# EAGLE design rhsspi (EAGLE 6.4)
AUTHOR_NAME: kps; PROJECT_NAME: Split keyboard; VERSION: 20130817
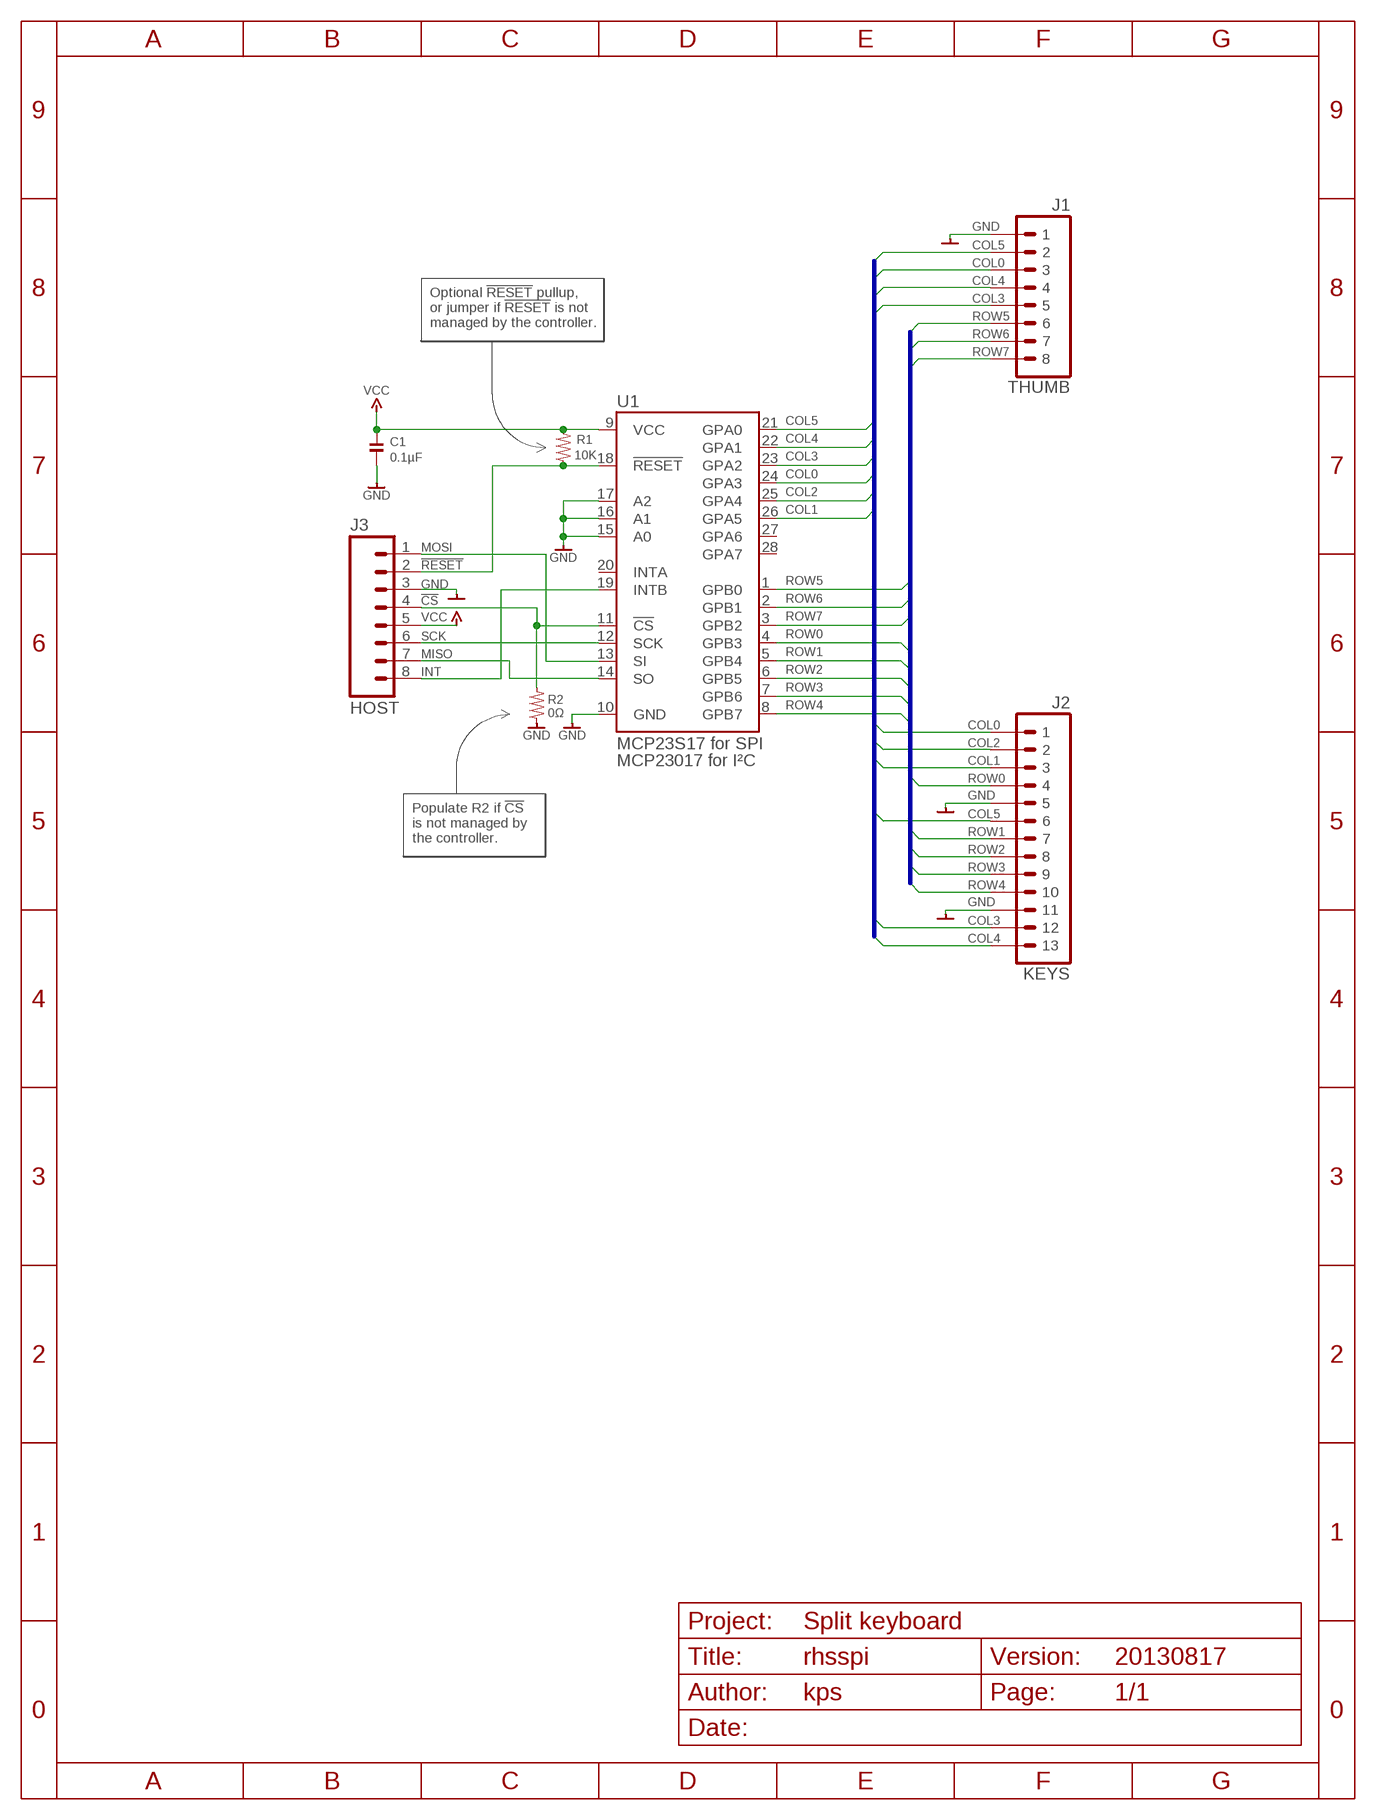
[diagram p0: schematic, sheet 1]

## Parts
C1  0.1µF  CAPACITOR-SCH200-1206  [SMD-1206]
J1  THUMB  J-8-2510  [J-8-2510]
J2  KEYS  J-13-100-ALT-R  [J-13-100-ALT-R]
J3  HOST  J-8-2510  [J-8-2510]
R1  10K  RESISTOR-1206  [SMD-1206]
R2  0Ω  RESISTOR-1206  [SMD-1206]
U1  MCP23S17 for SPI  IC-MCP23S17-SOIC  [IC-28-SOIC-300]

## Nets
!CS: J3.4 R2.2 U1.11(!CS)
!RESET: J3.2 R1.1 U1.18(!RESET)
COL0: J1.3 J2.P1 U1.24(GPA3)
COL1: J2.P3 U1.26(GPA5)
COL2: J2.P2 U1.25(GPA4)
COL3: J1.5 J2.P12 U1.23(GPA2)
COL4: J1.4 J2.P13 U1.22(GPA1)
COL5: J1.2 J2.P6 U1.21(GPA0)
GND: C1.2 J1.1 J2.P5 J2.P11 J3.3 R2.1 U1.10(GND) U1.15(A0) U1.16(A1) U1.17(A2)
INT: J3.8 U1.19(INTB)
MISO: J3.7 U1.14(SO)
MOSI: J3.1 U1.13(SI)
ROW0: J2.P4 U1.4(GPB3)
ROW1: J2.P7 U1.5(GPB4)
ROW2: J2.P8 U1.6(GPB5)
ROW3: J2.P9 U1.7(GPB6)
ROW4: J2.P10 U1.8(GPB7)
ROW5: J1.6 U1.1(GPB0)
ROW6: J1.7 U1.2(GPB1)
ROW7: J1.8 U1.3(GPB2)
SCK: J3.6 U1.12(SCK)
VCC: C1.1 J3.5 R1.2 U1.9(VCC)
Unconnected: U1.20(INTA) U1.27(GPA6) U1.28(GPA7)

## Buses
COL[0..5]
ROW[0..7]

## Notes on the sheet
- Optional !RESET! pullup,
  or jumper if !RESET! is not
  managed by the controller.
- MCP23017 for I²C
- Populate R2 if !CS!
  is not managed by
  the controller.

## Library data of the parts
C1 = misc:CAPACITOR-SCH200
J1 = conn:J-8: 8 pin connector
J2 = conn:J-13: 13 pin connector
J3 = wtf:J-8: 8 pin connector
R1 R2 = misc:RESISTOR
U1 = ic:IC-MCP23S17: Microchip 16-bit I/O Expander MCP23017 - I²C MCP23018 - I²C, open collector, 5V tolerant MCP23S17 - SPI, addressing MCP23S18 - SPI, open collector, 5V tolerant

## Board
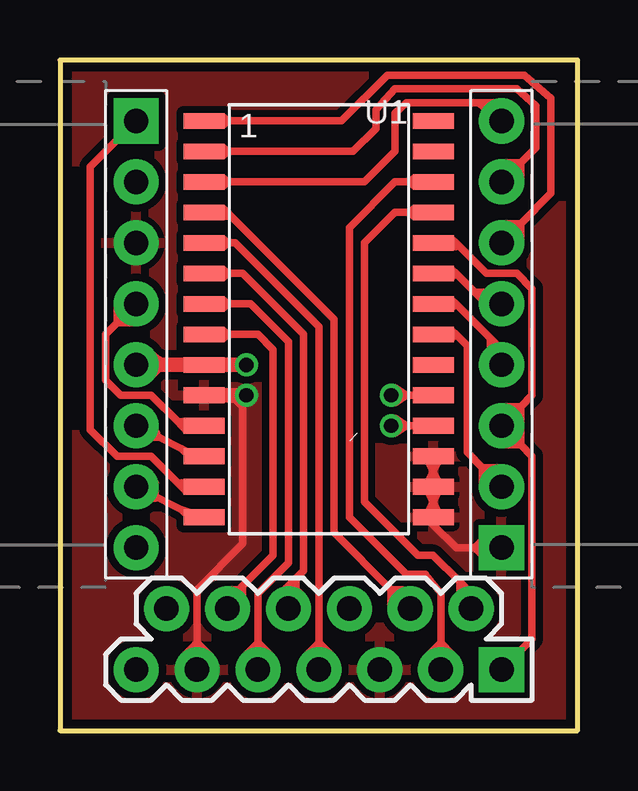
[diagram p1: board, top side]
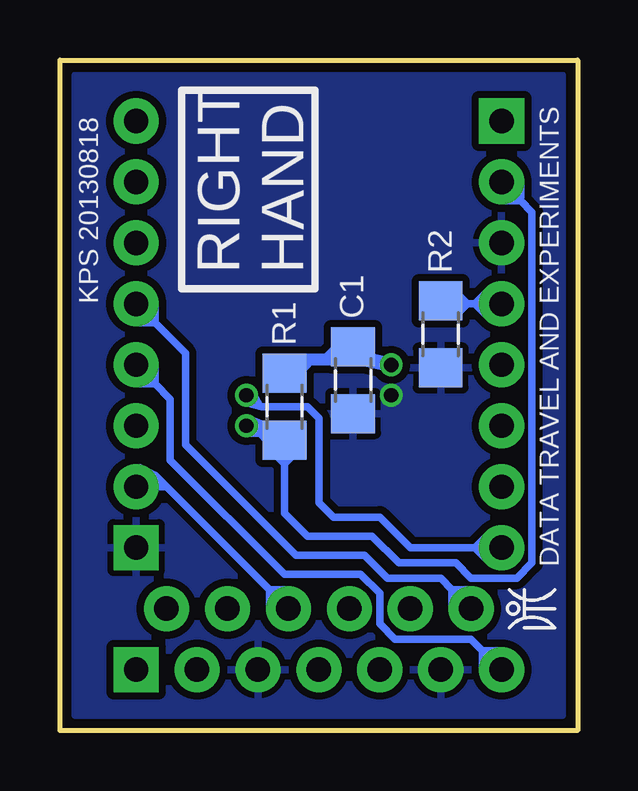
[diagram p2: board, bottom side, seen from below]

Size 21.59 x 27.94 mm. Coordinates in mm from the lower left corner, seen from the top.
Outline: 0,0 21.59,0 21.59,27.94 0,27.94 0,0
Copper layers (1*16): Top 0.0356mm / dielectric 1.5011mm / Bottom 0.0356mm
Design rules "LaenPCBOrder": minimum track width 6mil, minimum drill 13mil, track to track 6mil, track to pad 6mil, pad to pad 6mil, via to via 6mil, smd to smd 6mil, copper to edge 15mil, drill to drill 6mil, minimum pad ring 7mil, minimum via ring 7mil, stop-mask expansion 4mil, vias tented up to drill 0mil, thermal gap 10mil

### Footprints (pad centres in the part's own frame; a part is rotated, then mirrored left to right if it is on the bottom)
SMD-1206 = smd 1.626 x 1.829: 1 -1.397,0; 2 1.397,0
J-8-2510 = drill 1.016 pad 1.88 square: 1 0,-8.89 | drill 1.016 pad 1.88: 2 0,-6.35; 3 0,-3.81; 4 0,-1.27; 5 0,1.27; 6 0,3.81; 7 0,6.35; 8 0,8.89
J-13-100-ALT-R = drill 1.016 pad 1.88 square: P1 5.08,0 | drill 1.016 pad 1.88: P2 3.81,2.54; P3 2.54,0; P4 1.27,2.54; P5 0,0; P6 -1.27,2.54; P7 -2.54,0; P8 -3.81,2.54; P9 -5.08,0; P10 -6.35,2.54; P11 -7.62,0; P12 -8.89,2.54; P13 -10.16,0
IC-28-SOIC-300 = smd 0.65 x 1.7: 1 -8.255,-4.78; 2 -6.985,-4.78; 3 -5.715,-4.78; 4 -4.445,-4.78; 5 -3.175,-4.78; 6 -1.905,-4.78; 7 -0.635,-4.78; 8 0.635,-4.78; 9 1.905,-4.78; 10 3.175,-4.78; 11 4.445,-4.78; 12 5.715,-4.78; 13 6.985,-4.78; 14 8.255,-4.78; 15 8.255,4.78; 16 6.985,4.78; 17 5.715,4.78; 18 4.445,4.78; 19 3.175,4.78; 20 1.905,4.78; 21 0.635,4.78; 22 -0.635,4.78; 23 -1.905,4.78; 24 -3.175,4.78; 25 -4.445,4.78; 26 -5.715,4.78; 27 -6.985,4.78; 28 -8.255,4.78

### Placement (x,y rotation side)
C1  9.37,14.61 270 bottom
J1  18.41,16.51 0 top
J2  13.34,2.54 0 top
J3  3.17,16.51 180 top
R1  12.22,13.49 90 bottom
R2  5.71,16.51 90 bottom
U1  10.79,17.14 270 top

### Tracks (layer width: path | path; a pad name or v marks a point on that pad's centre or on a via)
!CS
  Top 0.305: U1.11 5.08,12.7 | 5.08,12.7 4.92,12.86 | 4.92,12.86 3.81,13.97 2.54,13.97 1.91,14.61 1.91,16.51 2.38,16.99 | 2.38,16.99 J3.4 | 5.08,12.7 5.24,12.54 | 4.92,12.86 5.24,12.86 | 2.38,17.78 2.38,16.99 | 2.38,16.99 3.17,16.99
  Bottom 0.305: J3.4 4.29,17.78 | 4.29,17.78 4.6,17.78 | 4.6,17.78 5.58,17.78 arc90 R2.2 | 3.81,18.26 4.29,17.78 | 4.29,17.78 3.65,17.14 | 5.24,18.26 5.08,18.26 4.6,17.78 | 4.6,17.78 5.08,17.3
!RESET  (via drill 0.6)
  Top 0.305: U1.18 14.45,12.7 | 14.45,12.7 v13.81,12.7 | 13.97,13.02 14.45,12.7 | 14.45,12.7 13.97,12.38
  Bottom 0.305: 2.38,22.23 2.38,22.86 J3.2 | J3.2 3.17,22.07 2.38,22.07 | 13.02,12.7 v13.81,12.7 13.81,12.38 13.02,12.38 12.86,11.91 13.34,12.54 | 13.02,12.7 11.91,12.7 R1.1 12.22,11.11 | 12.22,11.11 12.22,9.05 11.27,8.1 8.57,8.1 7.46,6.99 5.08,6.99 4.45,6.35 2.54,6.35 1.91,6.99 1.91,21.59 2.38,22.07 | 2.38,22.07 J3.2 | 11.91,11.43 12.22,11.11 | 12.22,11.11 12.54,11.43 | 13.81,13.02 13.02,12.7
COL0
  Top 0.305: U1.24 16.51,20.32 | 16.51,20.32 17.78,19.05 19.05,19.05 19.68,18.41 19.68,13.97 19.21,13.49 | 19.21,13.49 J1.3 19.21,11.91 | 19.21,11.91 19.68,11.43 19.68,3.81 J2.P1 | 16.19,20.48 16.35,20.48 16.51,20.32 | 16.51,20.32 16.51,20.16 | 18.41,13.49 19.21,13.49 | 19.21,13.49 19.21,11.91 | 19.21,11.91 18.57,11.91
COL1
  Top 0.305: J2.P3 15.88,3.65 | 15.88,3.65 15.88,5.71 15.24,6.51 14.45,6.51 12.06,8.89 12.06,20.95 13.97,22.86 14.61,22.86 | 14.61,22.86 U1.26 | 14.92,23.02 14.76,23.02 14.61,22.86 | 14.61,22.86 14.76,22.7 | 15.4,3.17 15.88,3.65 | 15.88,3.65 16.35,3.17
COL2
  Top 0.305: J2.P2 17.14,5.71 16.67,6.19 | 16.67,6.19 15.56,7.3 14.92,7.3 12.7,9.53 12.7,20.32 13.97,21.59 14.61,21.59 | 14.61,21.59 U1.25 | 14.92,21.75 14.76,21.75 14.61,21.59 | 14.61,21.59 14.76,21.43 | 16.67,6.19 16.67,5.71
COL3
  Top 0.305: U1.23 16.51,19.05 | 16.51,19.05 17.3,18.26 | 17.3,18.26 17.78,17.78 J1.5 | 16.19,19.21 16.35,19.21 16.51,19.05 | 16.51,19.05 16.35,18.89 | 17.94,18.26 17.3,18.26
  Bottom 0.305: J2.P12 5.24,5.87 | 5.24,5.87 5.71,6.35 7.94,6.35 8.89,7.3 11.75,7.3 16.35,11.91 16.35,15.72 17.62,16.99 | 17.62,16.99 J1.5 | 4.6,5.87 5.24,5.87 | 5.24,5.87 5.24,5.24 | 17.62,17.78 17.62,16.99 | 17.62,16.99 18.41,16.99
COL4
  Top 0.305: U1.22 16.51,17.78 | 16.51,17.78 17.94,16.35 | 17.94,16.35 18.41,15.88 J1.4 | 16.35,17.94 16.51,17.78 | 16.51,17.78 16.35,17.62 | 17.94,16.35 17.94,15.88
  Bottom 0.305: J2.P13 3.97,3.33 | 3.97,3.33 4.45,3.81 7.62,3.81 8.26,4.45 8.26,5.71 9.05,6.51 12.22,6.51 16.99,11.27 16.99,13.81 17.62,14.45 | 17.62,14.45 J1.4 | 3.33,3.33 3.97,3.33 | 3.97,3.33 3.97,2.7 | 17.62,15.24 17.62,14.45 | 17.62,14.45 18.41,14.45
COL5
  Top 0.305: U1.21 16.51,16.51 | 16.51,16.51 16.99,16.03 16.99,11.59 17.62,10.95 | 17.62,10.95 J1.2 | 16.19,16.67 16.35,16.67 16.51,16.51 | 16.51,16.51 16.35,16.35 | 17.62,10.32 17.62,10.95 | 17.62,10.95 18.26,10.95
  Bottom 0.305: J2.P6 12.86,5.87 | 12.86,5.87 17.14,10.16 | 17.14,10.16 J1.2 | 12.06,5.87 12.86,5.87 | 12.86,5.87 12.86,5.08 | 17.14,10.16 17.62,10.64 18.26,10.95
GND  (via drill 0.6)
  Top 0.305: U1.15 15.56,8.89 15.56,8.57 16.53,7.62 17.3,7.62 | 17.3,7.62 J1.1 | v7.78,13.97 7.62,13.49 | 7.62,13.49 7.62,7.78 5.71,5.87 5.71,3.65 | 5.71,3.65 J2.P11 | 17.62,7.3 17.3,7.62 | 17.3,7.62 17.62,7.94 | 5.24,3.17 5.71,3.65 | 5.71,3.65 6.19,3.17 | 7.14,13.81 7.3,13.81 7.62,13.49 | 15.24,8.89 15.88,10.16 15.24,11.43 15.88,11.43 15.24,10.16 15.88,8.89
  Top 0.61: v7.78,13.97 U1.10
  Bottom 0.61: C1.2 9.15,13.71
  pour Bottom (isolate 0.305): 0.64,27.3 20.95,27.3 20.95,0.64 0.64,0.64
  pour Top (isolate 0.305): 0.64,0.64 20.95,0.64 20.95,27.3 0.64,27.3
INT  (via drill 0.6)
  Top 0.305: U1.19 14.45,13.97 | 14.45,13.97 v13.81,13.97 | 13.97,14.29 14.45,13.97 | 14.45,13.97 13.97,13.65
  Bottom 0.305: 13.18,13.49 v13.81,13.97 13.49,13.65 13.34,13.65 13.49,13.97 | 13.18,13.49 11.27,13.49 10.79,13.02 10.79,9.5 10.19,8.89 8.26,8.89 6.99,7.62 4.29,7.62 | 4.29,7.62 J3.8 | 4.29,7.62 3.81,8.1 3.81,7.14 4.29,7.62 | 13.18,13.49 13.81,13.65
MISO
  Top 0.305: U1.14 5.08,9.21 | 5.08,9.21 3.68,9.91 J3.7 | 5.08,9.21 5.4,8.89 | 3.97,10.32 3.97,9.68 3.65,9.68
  Top 0.406: 3.65,9.68 3.68,9.68 3.68,9.91
MOSI
  Top 0.305: U1.13 5.08,10.16 | 5.08,10.16 3.81,11.43 2.38,11.43 1.27,12.54 1.27,23.5 J3.1 | 5.08,10.32 5.08,10.16 | 5.08,10.16 5.24,10
ROW0
  Top 0.305: J2.P4 13.81,5.87 | 13.81,5.87 11.43,8.26 11.43,17.14 7.14,21.43 | 7.14,21.43 6.99,21.59 | 6.99,21.59 U1.4 | 13.81,5.24 13.81,5.87 | 13.81,5.87 14.29,5.87 | 6.67,21.75 6.83,21.75 6.99,21.59 | 6.67,21.43 7.14,21.43
ROW1
  Top 0.305: J2.P7 10.79,3.65 | 10.79,3.65 10.79,16.83 7.3,20.32 6.99,20.32 | 6.99,20.32 U1.5 | 10.32,3.17 10.79,3.65 | 10.79,3.65 11.27,3.17 | 6.83,20.48 6.99,20.32 | 6.99,20.32 6.83,20.16
ROW2
  Top 0.305: J2.P8 9.53,6.03 | 9.53,6.03 9.84,6.35 | 9.84,6.35 10.16,6.67 10.16,16.51 7.62,19.05 6.99,19.05 | 6.99,19.05 U1.6 | 9.21,5.71 9.53,6.03 | 9.84,6.35 9.84,5.87 10,5.71 | 6.67,19.21 6.83,19.21 6.99,19.05 | 6.99,19.05 6.83,18.89
ROW3
  Top 0.305: J2.P9 8.26,3.65 | 8.26,3.65 8.26,5.71 9.53,6.99 9.53,16.19 7.94,17.78 6.99,17.78 | 6.99,17.78 U1.7 | 7.78,3.17 8.26,3.65 | 8.26,3.65 8.73,3.17 | 6.83,17.94 6.99,17.78 | 6.99,17.78 6.83,17.62
ROW4
  Top 0.305: J2.P10 6.99,5.4 7.46,5.87 | 7.46,5.87 7.62,6.03 | 7.62,6.03 8.89,7.3 8.89,15.88 8.26,16.51 6.99,16.51 | 6.99,16.51 U1.8 | 6.99,5.87 7.46,5.87 | 7.62,6.03 7.62,5.4 | 6.83,16.67 6.99,16.51 | 6.99,16.51 6.83,16.35
ROW5
  Top 0.305: U1.1 6.99,25.4 | 6.99,25.4 11.75,25.4 13.65,27.3 19.37,27.3 20.48,26.35 20.48,22.38 19.21,21.11 | 19.21,21.11 J1.6 | 18.41,21.11 19.21,21.11 | 19.21,21.11 19.21,20.48 | 6.67,25.56 6.83,25.56 6.99,25.4 | 6.99,25.4 6.83,25.24
ROW6
  Top 0.305: U1.2 6.99,24.13 | 6.99,24.13 12.22,24.13 13.18,25.08 13.18,25.88 13.97,26.73 19.05,26.73 19.84,26.04 19.84,24.29 19.21,23.65 | 19.21,23.65 J1.7 | 18.41,23.65 19.21,23.65 | 19.21,23.65 19.21,22.86 | 6.67,24.29 6.83,24.29 6.99,24.13 | 6.99,24.13 6.83,23.97
ROW7
  Top 0.305: U1.3 6.99,22.86 | 6.99,22.86 12.7,22.86 13.97,24.13 13.97,25.72 14.45,26.16 18.41,26.16 J1.8 | 6.67,23.02 6.83,23.02 6.99,22.86 | 6.99,22.86 6.83,22.7 | 17.3,26.16 17.46,26.16 17.94,25.72
  Top 0.406: J1.8 17.94,25.4 17.94,25.72
SCK
  Top 0.305: U1.12 5.71,11.43 5.08,11.75 | 5.08,11.75 4.13,12.22 | 4.13,12.22 3.68,12.45 J3.6 | 5.08,11.75 5.4,11.43 | 3.65,12.22 4.13,12.22 | 3.97,12.7 3.97,12.38
  Top 0.406: 3.97,12.38 3.68,12.38 3.68,12.45
VCC  (via drill 0.6)
  Top 0.305: 4.29,15.24 3.81,14.76 | 3.65,15.72 3.81,15.72 4.13,15.4
  Top 0.406: 4.29,15.24 4.13,15.24 4.13,15.4
  Top 0.61: J3.5 4.29,15.24 U1.9 v7.78,15.24
  Bottom 0.305: R1.2 11.61,15.51 | 12.22,15.54 R1.2 | 9.37,16.03 C1.1 10.03,16 10.53,15.51 11.61,15.51 | 11.61,15.51 11.69,15.51 11.75,15.45 | 11.11,15.4 11.35,15.16 | 11.35,15.16 11.75,14.76 | R1.2 11.78,14.89 11.43,15.24 11.35,15.16
  Bottom 0.49: 9.84,15.45 11.75,15.45
  Bottom 0.61: C1.1 9.15,15.54 v7.78,15.24

### Text on the board
bPlace: RIGHT / HAND | KPS 20130818 | DATA TRAVEL AND EXPERIMENTS
tDocu: 23S17 / 23017 | HOST: | THUMB: